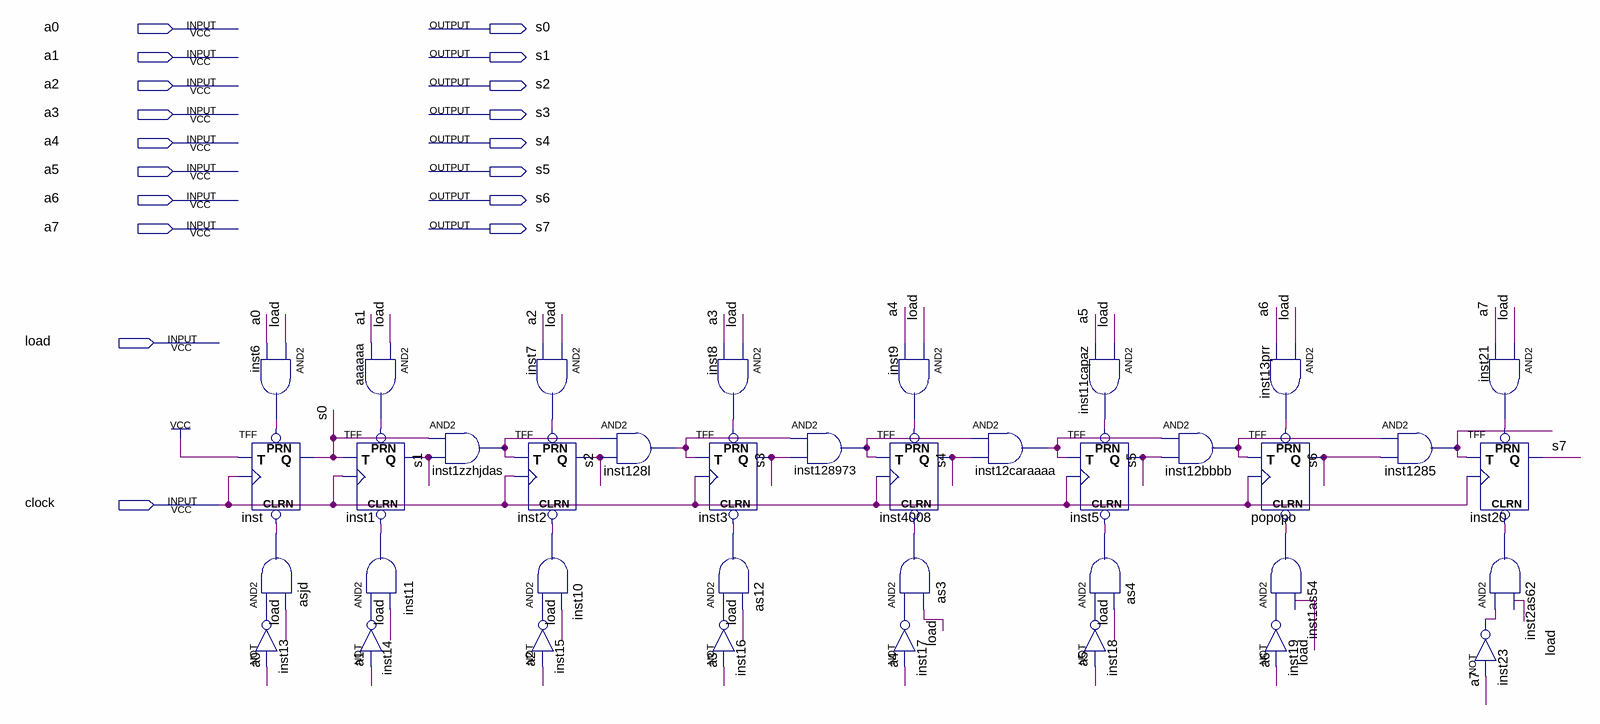
[diagram p0: schematic sheet]
// Quartus schematic counter.bdf as structural Verilog: 38 symbols, 18 pins
module counter (
  input  a0,
  input  a1,
  input  a2,
  input  a3,
  input  a4,
  input  a5,
  input  a6,
  input  a7,
  input  load,
  input  clock,
  output s0,
  output s1,
  output s2,
  output s3,
  output s4,
  output s5,
  output s6,
  output s7
);

  wire aaaaaa_out, as3_out, as4_out, as12_out, asjd_out, inst1as54_out, inst1zzhjdas_out, inst2as62_out,
       inst6_out, inst7_out, inst8_out, inst9_out, inst10_out, inst11_out, inst11capaz_out, inst12bbbb_out,
       inst12caraaaa_out, inst13_out, inst13prr_out, inst14_out, inst15_out, inst16_out, inst17_out,
       inst18_out, inst19_out, inst21_out, inst23_out, inst128l_out, inst1285_out, inst128973_out;

  and inst6 (inst6_out, load, a0);
  TFF inst (.PRN(inst6_out), .CLRN(asjd_out), .T(1'b1), .CLK(clock), .Q(s0));
  and asjd (asjd_out, inst13_out, load);
  not inst13 (inst13_out, a0);
  and aaaaaa (aaaaaa_out, load, a1);
  TFF inst1 (.PRN(aaaaaa_out), .CLRN(inst11_out), .T(s0), .CLK(clock), .Q(s1));
  and inst11 (inst11_out, inst14_out, load);
  not inst14 (inst14_out, a1);
  and inst1zzhjdas (inst1zzhjdas_out, s0, s1);
  and inst7 (inst7_out, load, a2);
  TFF inst2 (.PRN(inst7_out), .CLRN(inst10_out), .T(inst1zzhjdas_out), .CLK(clock), .Q(s2));
  and inst10 (inst10_out, inst15_out, load);
  not inst15 (inst15_out, a2);
  and inst128l (inst128l_out, inst1zzhjdas_out, s2);
  and inst8 (inst8_out, load, a3);
  TFF inst3 (.PRN(inst8_out), .CLRN(as12_out), .T(inst128l_out), .CLK(clock), .Q(s3));
  and as12 (as12_out, inst16_out, load);
  not inst16 (inst16_out, a3);
  and inst128973 (inst128973_out, inst128l_out, s3);
  and inst9 (inst9_out, load, a4);
  TFF inst4008 (.PRN(inst9_out), .CLRN(as3_out), .T(inst128973_out), .CLK(clock), .Q(s4));
  and as3 (as3_out, inst17_out, load);
  not inst17 (inst17_out, a4);
  and inst12caraaaa (inst12caraaaa_out, inst128973_out, s4);
  and inst11capaz (inst11capaz_out, load, a5);
  TFF inst5 (.PRN(inst11capaz_out), .CLRN(as4_out), .T(inst12caraaaa_out), .CLK(clock), .Q(s5));
  and as4 (as4_out, inst18_out, load);
  not inst18 (inst18_out, a5);
  and inst12bbbb (inst12bbbb_out, inst12caraaaa_out, s5);
  and inst13prr (inst13prr_out, load, a6);
  TFF popopo (.PRN(inst13prr_out), .CLRN(inst1as54_out), .T(inst12bbbb_out), .CLK(clock), .Q(s6));
  and inst1as54 (inst1as54_out, inst19_out, load);
  not inst19 (inst19_out, a6);
  and inst1285 (inst1285_out, inst12bbbb_out, s6);
  and inst21 (inst21_out, load, a7);
  TFF inst20 (.PRN(inst21_out), .CLRN(inst2as62_out), .T(inst1285_out), .CLK(clock), .Q(s7));
  and inst2as62 (inst2as62_out, inst23_out, load);
  not inst23 (inst23_out, a7);
endmodule
